# EAGLE schematic CircoController (EAGLE 9.4.1)
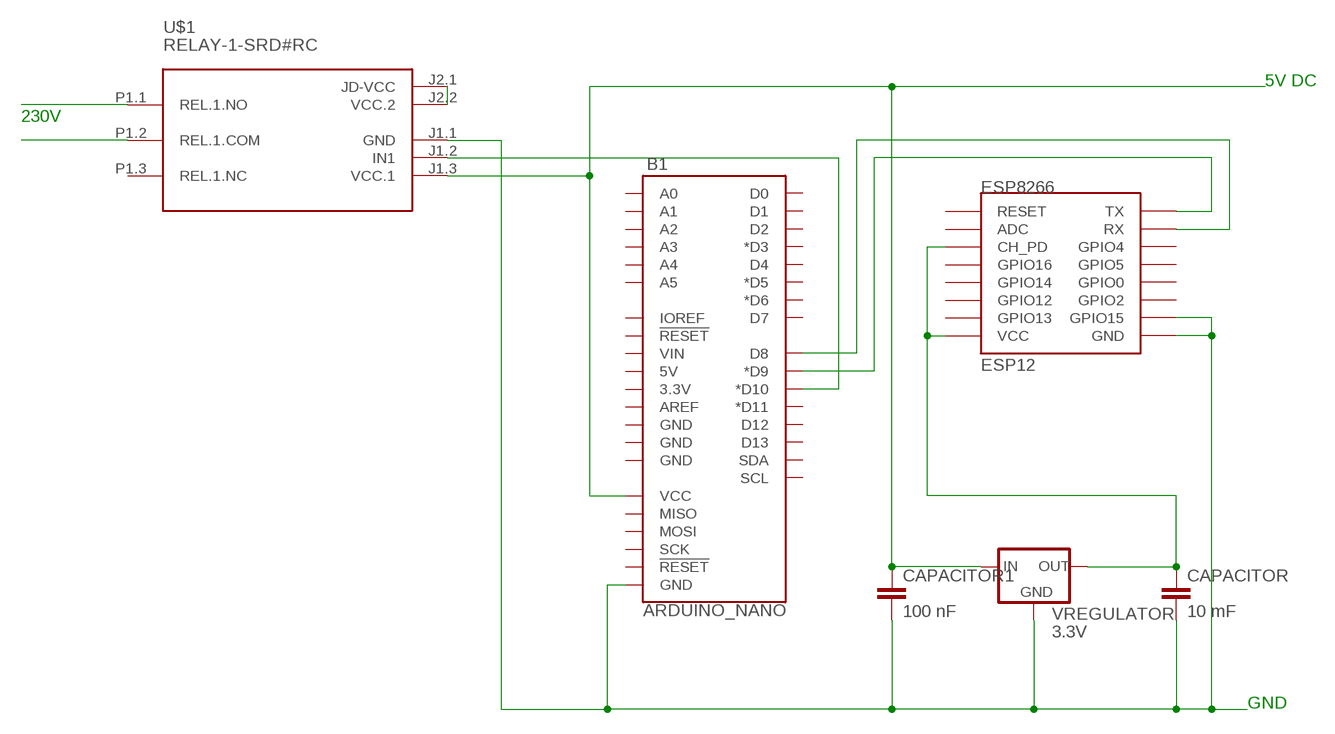
[diagram p0: schematic, sheet 1]

## Parts
B1  ARDUINO_NANO  ARDUINO_UNO_R3  [ARDUINO_R3]
CAPACITOR  10 mF  CAPACITOR_0201_L  [RESC0201_L]
CAPACITOR1  100 nF  CAPACITOR_0201_L  [RESC0201_L]
ESP8266  ESP12  [ESP12]
U$1  RELAY-1-SRD#RC  [RELAY-1-SRD#RC]
VREGULATOR  3.3V  78LXX  [78LXX]

## Nets
N$1: B1.D9(*D9) ESP8266.TX
N$2: B1.D8 ESP8266.RX
N$3: U$1.J2.1(JD-VCC) U$1.J2.2(VCC.2)
N$5: B1.D10(*D10) U$1.J1.2(IN1)
N$6: U$1.P1.2(REL.1.COM)
N$7: U$1.P1.1(REL.1.NO)
N$19: B1.GND@1(GND) CAPACITOR1.2 CAPACITOR.2 ESP8266.GND ESP8266.GPIO15 U$1.J1.1(GND) VREGULATOR.GND
N$20: B1.VCC CAPACITOR1.1 U$1.J1.3(VCC.1) VREGULATOR.IN
N$21: CAPACITOR.1 ESP8266.CH_PD ESP8266.VCC VREGULATOR.OUT
Unconnected: B1.3.3V B1.5V B1.A0 B1.A1 B1.A2 B1.A3 B1.A4 B1.A5 B1.AREF B1.D0 B1.D1 B1.D2 B1.D3(*D3) B1.D4 B1.D5(*D5) B1.D6(*D6) B1.D7 B1.D11(*D11) B1.D12 B1.D13 B1.GND@2(GND) B1.GND@3(GND) B1.GND@4(GND) B1.IOREF B1.MISO B1.MOSI B1.RESET@1(!RESET!) B1.RESET@2(!RESET!) B1.SCK B1.SCL B1.SDA B1.VIN ESP8266.ADC ESP8266.GPIO0 ESP8266.GPIO2 ESP8266.GPIO4 ESP8266.GPIO5 ESP8266.GPIO12 ESP8266.GPIO13 ESP8266.GPIO14 ESP8266.GPIO16 ESP8266.RESET U$1.P1.3(REL.1.NC)

## Notes on the sheet
- 5V DC
- 230V
- GND

## Library data of the parts
B1 = SparkFun-Boards:ARDUINO_UNO_R3: Arduino R3 Footprint with SPI header Arduino Uno R3 Compatible Footprint. Matches PCB size of the original board. SparkFun Products: SAMD21 Dev Breakout <https://www.sparkfun.com/products/13672> RedBoard <https://www.sparkfun.com/products/12757> R3 Stackable Headers <https://www.sparkfun.com/products/11417>
CAPACITOR CAPACITOR1 = Nordic_nRF:CAPACITOR: Generic chip capacitor
ESP8266 = esp8266modules:ESP12: ESP8266 Wifi module 12
U$1 = diy-modules:RELAY-1-SRD#RC: 1-Channel Relay Module based on SRD-05VDC-SL-C relays Symbol with relays pins Click here to find device on ebay.com <http://www.ebay.com/sch/one+channel+isolated+relay+5v>
VREGULATOR = DC_LOAD_AU:78LXX: VOLTAGE REGULATOR